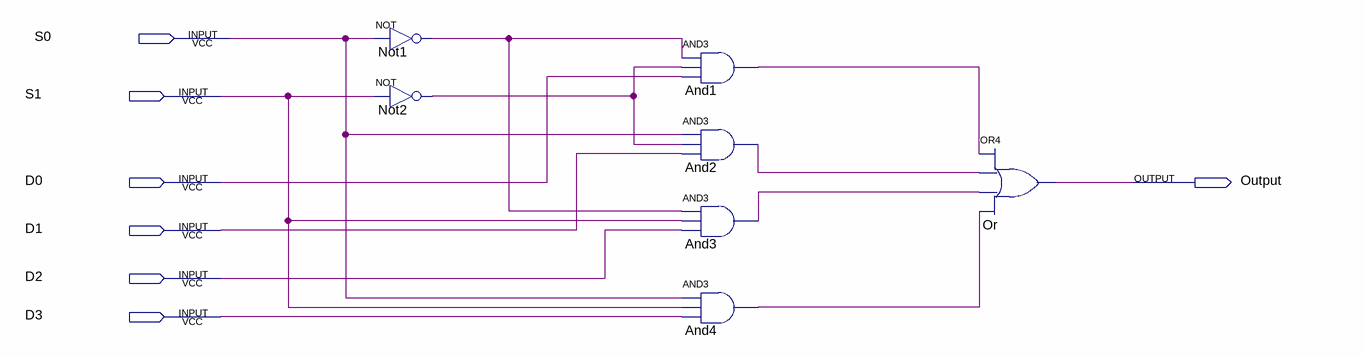
[diagram p0: schematic sheet]
// Quartus schematic 4_bit_selector.bdf as structural Verilog: 7 symbols, 7 pins
module \4_bit_selector  (
  input  S0,
  input  S1,
  input  D0,
  input  D1,
  input  D2,
  input  D3,
  output Output
);

  wire And1_out, And2_out, And3_out, And4_out, Not1_out, Not2_out;

  not Not1 (Not1_out, S0);
  not Not2 (Not2_out, S1);
  and And1 (And1_out, Not1_out, Not2_out, D0);
  and And2 (And2_out, S0, Not2_out, D1);
  and And3 (And3_out, Not1_out, S1, D2);
  and And4 (And4_out, S0, S1, D3);
  or Or (Output, And1_out, And2_out, And3_out, And4_out);
endmodule
